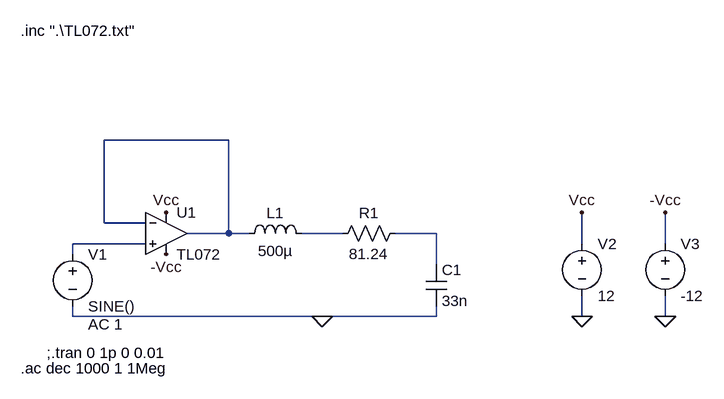
[diagram p0: schematic Draft1.asc]
Draft1.asc, the LTspice schematic file:
Version 4
SHEET 1 908 680
WIRE 176 -64 -16 -64
WIRE -16 64 -16 -64
WIRE 48 64 -16 64
WIRE 176 80 176 -64
WIRE 176 80 112 80
WIRE 208 80 176 80
WIRE 352 80 288 80
WIRE 496 80 432 80
WIRE 48 96 -64 96
WIRE 720 96 720 48
WIRE 848 96 848 48
WIRE -64 112 -64 96
WIRE 496 128 496 80
WIRE -64 208 -64 192
WIRE 320 208 -64 208
WIRE 496 208 496 192
WIRE 496 208 320 208
WIRE 720 208 720 176
WIRE 848 208 848 176
FLAG 320 208 0
FLAG 80 48 Vcc
FLAG 80 112 -Vcc
FLAG 720 208 0
FLAG 848 208 0
FLAG 720 48 Vcc
FLAG 848 48 -Vcc
SYMBOL res 448 64 R90
WINDOW 0 0 56 VBottom 2
WINDOW 3 32 56 VTop 2
SYMATTR InstName R1
SYMATTR Value 81.24
SYMBOL ind 192 96 R270
WINDOW 0 32 56 VTop 2
WINDOW 3 5 56 VBottom 2
SYMATTR InstName L1
SYMATTR Value 500µ
SYMBOL cap 480 128 R0
SYMATTR InstName C1
SYMATTR Value 33n
SYMBOL voltage -64 96 R0
WINDOW 123 24 124 Left 2
WINDOW 39 0 0 Left 0
SYMATTR Value2 AC 1
SYMATTR InstName V1
SYMATTR Value SINE()
SYMBOL Opamps\\opamp2 80 16 R0
SYMATTR InstName U1
SYMATTR Value TL072
SYMBOL voltage 720 80 R0
WINDOW 123 0 0 Left 0
WINDOW 39 0 0 Left 0
SYMATTR InstName V2
SYMATTR Value 12
SYMBOL voltage 848 80 R0
WINDOW 123 0 0 Left 0
WINDOW 39 0 0 Left 0
SYMATTR InstName V3
SYMATTR Value -12
TEXT -104 264 Left 2 !;.tran 0 1p 0 0.01
TEXT -144 -232 Left 2 !.inc ".\\TL072.txt"
TEXT -144 288 Left 2 !.ac dec 1000 1 1Meg

The netlist it stands for:
* Draft1.asc
R1 N003 N002 81.24
L1 N001 N002 500µ
C1 N003 0 33n
V1 N004 0 SINE() AC 1
XU1 N004 N001 Vcc -Vcc N001 TL072  ; pins In+ In- V+ V- OUT
V2 Vcc 0 12
V3 -Vcc 0 -12
;.tran 0 1p 0 0.01
.inc ".\TL072.txt"
.ac dec 1000 1 1Meg
.backanno
.end